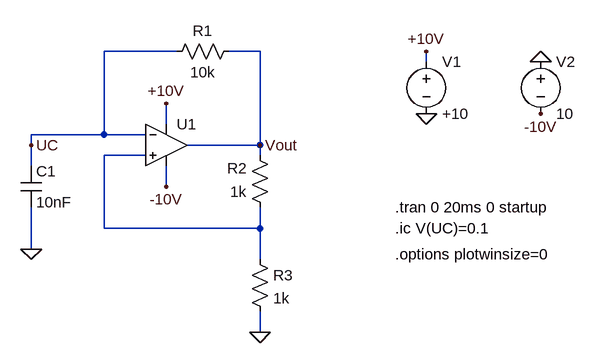
[diagram p0: schematic Multivibrator with OpAmp.asc]
Multivibrator with OpAmp.asc, the LTspice schematic file:
Version 4.1
SHEET 1 880 680
WIRE 208 -16 96 -16
WIRE 336 -16 288 -16
WIRE 592 0 592 -16
WIRE 192 96 192 64
WIRE 96 112 96 -16
WIRE 96 112 -16 112
WIRE 160 112 96 112
WIRE -16 128 -16 112
WIRE 336 128 336 -16
WIRE 336 128 224 128
WIRE 160 144 96 144
WIRE 336 144 336 128
WIRE -16 160 -16 128
WIRE 192 192 192 160
WIRE 96 256 96 144
WIRE 336 256 336 224
WIRE 336 256 96 256
WIRE -16 288 -16 224
WIRE 336 304 336 256
WIRE 336 416 336 384
FLAG 336 416 0
FLAG -16 288 0
FLAG 592 80 0
FLAG 592 -16 +10V
FLAG 192 64 +10V
FLAG 768 0 0
FLAG 768 80 -10V
FLAG 192 192 -10V
FLAG -16 128 UC
FLAG 336 128 Vout
SYMBOL res 304 -32 R90
WINDOW 0 0 56 VBottom 2
WINDOW 3 32 56 VTop 2
SYMATTR InstName R1
SYMATTR Value 10k
SYMBOL res 352 240 R180
WINDOW 0 36 76 Left 2
WINDOW 3 36 40 Left 2
SYMATTR InstName R2
SYMATTR Value 1k
SYMBOL res 320 288 R0
SYMATTR InstName R3
SYMATTR Value 1k
SYMBOL cap -32 160 R0
SYMATTR InstName C1
SYMATTR Value 10nF
SYMBOL voltage 592 -16 R0
WINDOW 123 0 0 Left 0
WINDOW 39 0 0 Left 0
SYMATTR InstName V1
SYMATTR Value +10
SYMBOL voltage 768 -16 R0
WINDOW 123 0 0 Left 0
WINDOW 39 0 0 Left 0
SYMATTR InstName V2
SYMATTR Value 10
SYMBOL OpAmps\\UniversalOpAmp2 192 128 R0
SYMATTR InstName U1
TEXT 544 296 Left 2 !.options plotwinsize=0
TEXT 544 224 Left 2 !.tran 0 20ms 0 startup
TEXT 544 256 Left 2 !.ic V(UC)=0.1

The netlist it stands for:
* Multivibrator with OpAmp.asc
R1 Vout UC 10k
R2 N001 Vout 1k
R3 N001 0 1k
C1 UC 0 10nF
V1 +10V 0 +10
V2 0 -10V 10
X§U1 N001 UC +10V -10V Vout level2 Avol=1Meg GBW=10Meg Slew=10Meg Ilimit=25m Rail=0 Vos=0 En=0 Enk=0 In=0 Ink=0 Rin=500Meg  ; pins In+ In- V+ V- OUT
.options plotwinsize=0
.tran 0 20ms 0 startup
.ic V(UC)=0.1
.lib UniversalOpAmp2.lib
.backanno
.end